# Altium schematic sheet Sheet6.SchDoc
size A4
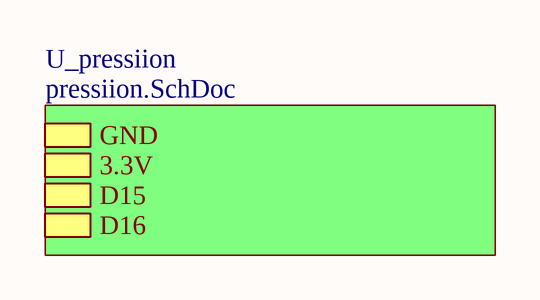
[diagram p0: Sheet6.SchDoc]

## Sub-sheets
U_pressiion = pressiion.SchDoc: GND, 3.3V, D15, D16